# EAGLE design test_add_res (EAGLE 6.4)
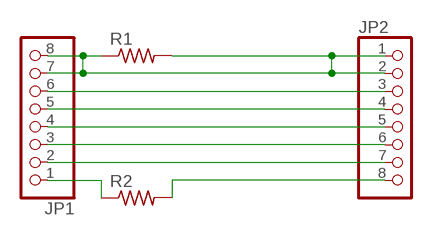
[diagram p0: schematic, sheet 1]

## Parts
JP1  PINHD-1X8  [1X08]
JP2  PINHD-1X8  [1X08]
R1  R-US_R0805  [R0805]
R2  R-US_R0805  [R0805]

## Nets
N$4: JP1.7 JP1.8 JP2.1 JP2.2 R1.1 R1.2
N$5: JP1.6 JP2.3
N$6: JP1.5 JP2.4
N$7: JP1.4 JP2.5
N$8: JP1.3 JP2.6
N$9: JP1.2 JP2.7
N$10: JP2.8 R2.2
N$11: JP1.1 R2.1

## Library data of the parts
JP1 JP2 = pinhead:PINHD-1X8: PIN HEADER
R1 R2 = rcl:R-US_: RESISTOR, American symbol

## Board
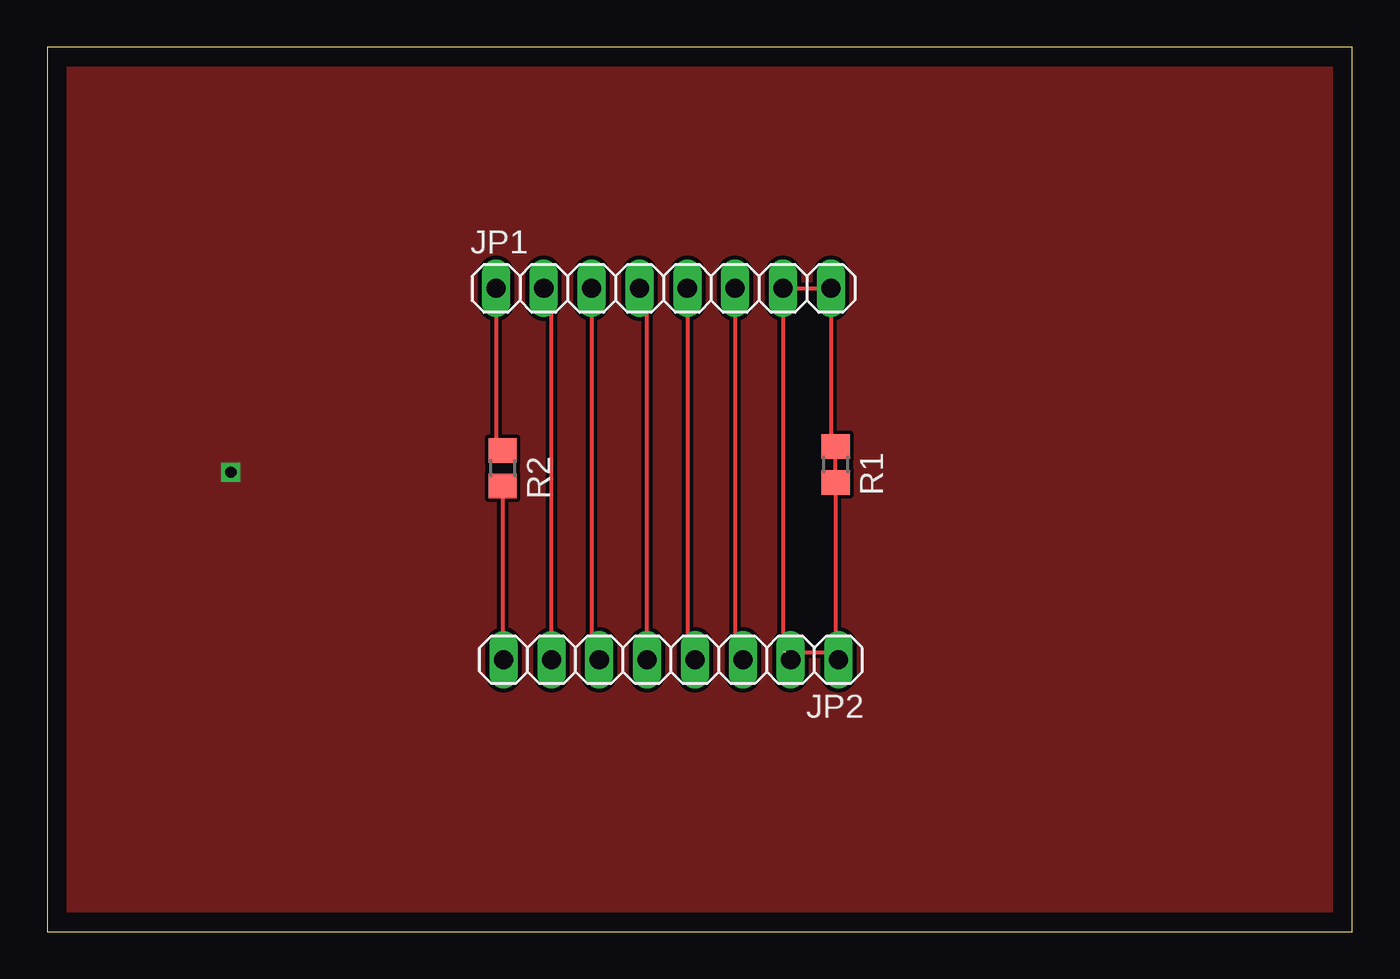
[diagram p1: board, top side]
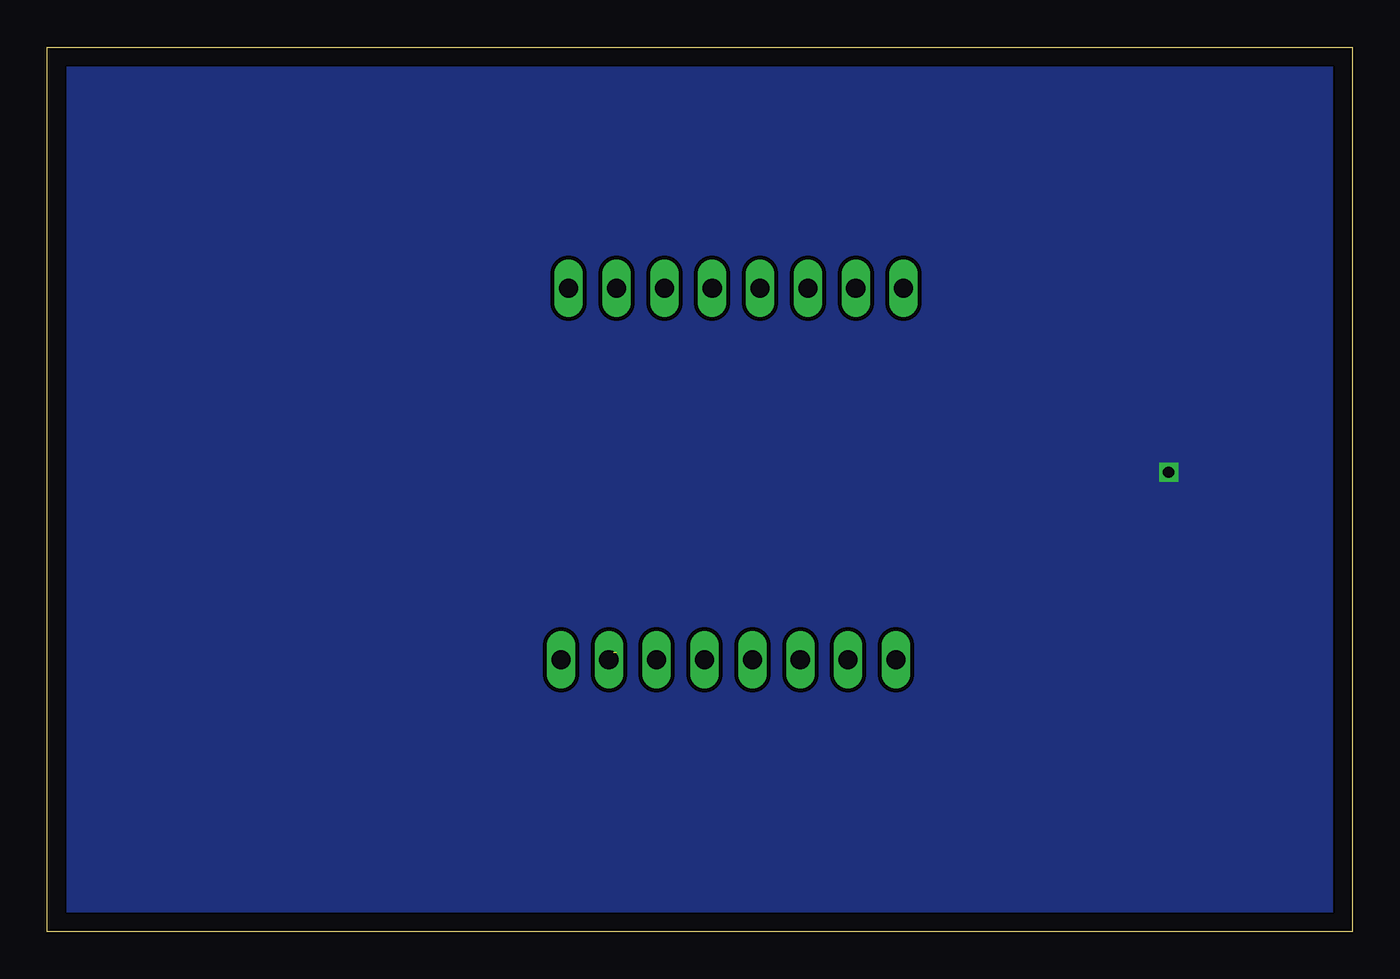
[diagram p2: board, bottom side, seen from below]

Size 69.29 x 46.94 mm. Coordinates in mm from the lower left corner, seen from the top.
Outline: 0,0 69.29,0 69.29,46.94 0,46.94 0,0
Copper layers (1*2*3*16): Top 0.035mm / dielectric 1.5mm / Route2 0.035mm / dielectric 0.15mm / Route3 0.035mm / dielectric 0.2mm / Bottom 0.035mm
Design rules "default *": minimum track width 10mil, minimum drill 24mil, track to track 8mil, track to pad 8mil, pad to pad 8mil, via to via 8mil, smd to smd 8mil, copper to edge 40mil, drill to drill 8mil, minimum pad ring 10mil, minimum via ring 8mil, stop-mask expansion 4mil, vias tented up to drill 0mil, thermal gap 10mil

### Footprints (pad centres in the part's own frame; a part is rotated, then mirrored left to right if it is on the bottom)
1X08 = drill 1.016 long: 1 -8.89,0; 2 -6.35,0; 3 -3.81,0; 4 -1.27,0; 5 1.27,0; 6 3.81,0; 7 6.35,0; 8 8.89,0
R0805 = smd 1.3 x 1.5: 1 -0.95,0; 2 0.95,0

### Placement (x,y rotation side)
JP1  32.72,34.14 0 top
JP2  33.12,14.43 180 top
R1  41.86,24.79 270 top
R2  24.18,24.59 270 top

### Tracks (layer width: path | path; a pad name or v marks a point on that pad's centre or on a via)
GND  (via drill 0.6)
  other vias: 9.75,24.38
  pour Top: 0.2,46.74 69.09,46.74 69.09,0.2 0.2,0.2
  pour Bottom: 0.2,46.74 69.09,46.74 69.09,0.2 0.2,0.2
N$1
  Top 0.203: 39.01,34.14 41.45,34.14
N$4  (1 unrouted)
  Top 0.203: JP1.8 41.61,26.21 | 41.61,26.21 41.61,25.99 R1.1 | 41.86,14.83 R1.2 41.86,25.96 41.61,26.21 | JP2.1 41.86,14.58 41.86,14.63 41.86,14.83 | JP1.7 39.07,14.83 JP2.2 | 39.22,14.83 41.86,14.83
N$5
  Top 0.203: JP1.6 36.53,14.83 JP2.3
N$6
  Top 0.203: JP1.5 33.99,14.83 JP2.4
N$7
  Top 0.203: JP2.5 31.85,33.73 JP1.4
N$8
  Top 0.203: JP1.3 28.91,14.83 JP2.6
N$9
  Top 0.203: JP2.7 26.77,33.73 JP1.2
N$10
  Top 0.203: R2.2 24.18,14.48 JP2.8
N$11
  Top 0.203: JP1.1 23.83,25.89 R2.1